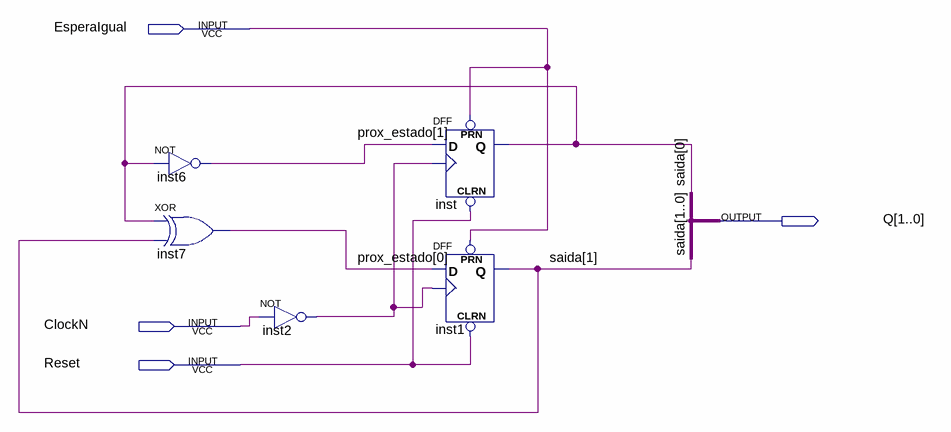
[diagram p0: schematic sheet]
// Quartus schematic maq_estados.bdf as structural Verilog: 5 symbols, 4 pins
module maq_estados (
  input  EsperaIgual,
  input  ClockN,
  input  Reset,
  output [1:0] Q
);

  wire inst2_out;
  wire [1:0] prox_estado;

  not inst6 (prox_estado[1], Q[0]);
  xor inst7 (prox_estado[0], Q[0], Q[1]);
  not inst2 (inst2_out, ClockN);
  DFF inst (.CLRN(Reset), .CLK(inst2_out), .D(prox_estado[1]), .PRN(EsperaIgual), .Q(Q[0]));
  DFF inst1 (.CLRN(Reset), .CLK(inst2_out), .D(prox_estado[0]), .PRN(EsperaIgual), .Q(Q[1]));

  // Other names for the same wires on the sheet: saida[1:0] = Q
endmodule
